# EAGLE design AMP 1.2 (EAGLE 6.5.0)
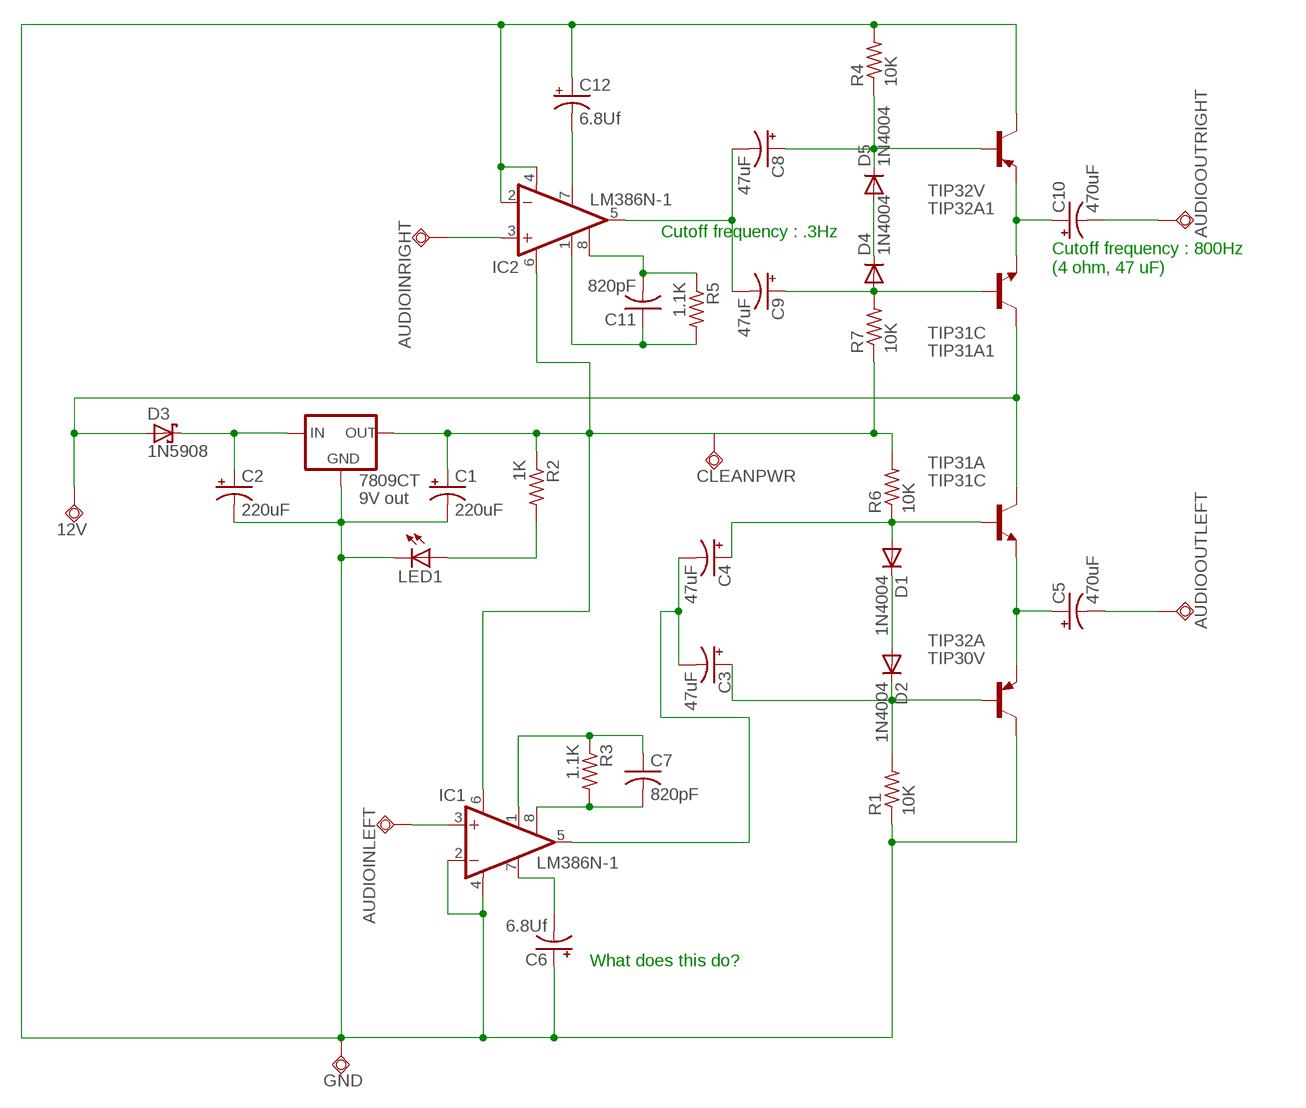
[diagram p0: schematic, sheet 1]

## Parts
12V  TPSQPAD1-20  [P1-20]
7809CT  9V out  78XXS  [78XXS]
AUDIOINLEFT  TPSQPAD1-20  [P1-20]
AUDIOINRIGHT  TPSQPAD1-20  [P1-20]
AUDIOOUTLEFT  TPSQPAD1-20  [P1-20]
AUDIOOUTRIGHT  TPSQPAD1-20  [P1-20]
C1  220uF  CPOL-USB45181C  [B45181C]
C2  220uF  CPOL-USB45181C  [B45181C]
C3  47uF  CPOL-USE5-4  [E5-4]
C4  47uF  CPOL-USE5-4  [E5-4]
C5  470uF  CPOL-USE5-4  [E5-4]
C6  6.8Uf  CPOL-USE5-4  [E5-4]
C7  820pF  C-US050-050X075  [C050-050X075]
C8  47uF  CPOL-USE5-4  [E5-4]
C9  47uF  CPOL-USE5-4  [E5-4]
C10  470uF  CPOL-USE5-4  [E5-4]
C11  820pF  C-US050-050X075  [C050-050X075]
C12  6.8Uf  CPOL-USE5-4  [E5-4]
CLEANPWR  TPSQPAD1-20  [P1-20]
D1  1N4004  [DO41-10]
D2  1N4004  [DO41-10]
D3  1N5908  [C4111-15]
D4  1N4004  [DO41-10]
D5  1N4004  [DO41-10]
GND  TPSQPAD1-20  [P1-20]
IC1  LM386N-1  [DIL08]
IC2  LM386N-1  [DIL08]
LED1  LED5MM  [LED5MM]
R1  10K  R-US_0204/7  [0204/7]
R2  1K  R-US_0204/7  [0204/7]
R3  1.1K  R-US_0204/7  [0204/7]
R4  10K  R-US_0204/7  [0204/7]
R5  1.1K  R-US_0204/7  [0204/7]
R6  10K  R-US_0204/7  [0204/7]
R7  10K  R-US_0204/7  [0204/7]
TIP31A  TIP31C  [TO220V]
TIP31A1  TIP31C  [TO220V]
TIP32A  TIP30V  [TO220V]
TIP32A1  TIP32V  [TO220V]

## Nets
AALFT: C3.- C4.- IC1.5(OUT)
AARGHT: C8.- C9.- IC2.5(OUT)
ALFT: AUDIOINLEFT.TP IC1.3(+IN)
ARGHT: AUDIOINRIGHT.TP IC2.3(+IN)
AULEFT: AUDIOOUTLEFT.TP C5.-
AURIGHT: AUDIOOUTRIGHT.TP C10.-
BUFFEREDDIRTY [Power]: 7809CT.IN C2.+ D3.C
CLEAN9V [Cleanpower]: 7809CT.OUT C1.+ CLEANPWR.TP IC1.6(VS) IC2.6(VS) R2.1 R6.2 R7.1
CLEANPWR: C4.+ D1.A R6.1 TIP31A.1(B)
DIRTYPWR [Power]: 12V.TP D3.A TIP31A1.2(C) TIP31A.2(C)
GND [Power]: 7809CT.GND C1.- C2.- C6.+ C12.+ GND.TP IC1.2(-IN) IC1.4(GND) IC2.2(-IN) IC2.4(GND) LED1.K(C) R1.1 R4.2 TIP32A1.2(C) TIP32A.2(C)
N$1: D1.C D2.A
N$2: C3.+ D2.C R1.2 TIP32A.1(B)
N$4: C5.+ TIP31A.3(E) TIP32A.3(E)
N$10: LED1.A R2.2
N$12: C6.- IC1.7(BYPASS)
N$13: C7.2 IC1.8(GAIN) R3.2
N$15: C7.1 IC1.1(GAIN) R3.1
N$16: C10.+ TIP31A1.3(E) TIP32A1.3(E)
N$17: C8.+ D5.C R4.1 TIP32A1.1(B)
N$18: C9.+ D4.A R7.2 TIP31A1.1(B)
N$19: D4.C D5.A
N$25: C11.2 IC2.8(GAIN) R5.1
N$26: C11.1 IC2.1(GAIN) R5.2
N$27: C12.- IC2.7(BYPASS)

## Notes on the sheet
- Cutoff frequency : .3Hz
- Cutoff frequency : 800Hz
  (4 ohm, 47 uF)
- What does this do?

## Library data of the parts
12V AUDIOINLEFT AUDIOINRIGHT AUDIOOUTLEFT AUDIOOUTRIGHT CLEANPWR GND = testpad:TPSQ: Test pad
7809CT = v-reg:78XXS: VOLTAGE REGULATOR
C1-C6 C8-C10 C12 = rcl:CPOL-US: POLARIZED CAPACITOR, American symbol
C7 C11 = rcl:C-US: CAPACITOR, American symbol
D1 D2 D4 D5 = diode:1N4004: DIODE general purpose rectifier, 1 A
D3 = diode:1N5908: DIODE schottky
IC1 IC2 = linear:LM386?-*: Low Voltage Audio Power Amplifier Source: http://cache.national.com/ds/LM/LM386.pdf
LED1 = led:LED: LED OSRAM: - CHIPLED LG R971, LG N971, LY N971, LG Q971, LY Q971, LO R971, LY R971 LH N974, LH R974 LS Q976, LO Q976, LY Q976 LO Q996 - Hyper CHIPLED LW Q18S LB Q993, LB Q99A, LB R99A - SideLED LS A670, LO A670, LY A670, LG A670, LP A670 LB A673, LV A673, LT A673, LW A673 LH A674 LY A675 LS A676, LA A676, LO A676, LY A676, LW A676 LS A679, LY A679, LG A679 - Hyper Micro SIDELED® LS Y876, LA Y876, LO Y876, LY Y876 LT Y87S - SmartLED LW L88C, LW L88S LB L89C, LB L89S, LG L890 LS L89K, LO L89K, LY L89K LS L896, LA L896, LO L896, LY L896 - TOPLED LS T670, LO T670, LY T670, LG T670, LP T670 LSG T670, LSP T670, LSY T670, LOP T670, LYG T670 LG T671, LOG T671, LSG T671 LB T673, LV T673, LT T673, LW T673 LH T674 LS T676, LA T676, LO T676, LY T676, LB T676, LH T676, LSB T676, LW T676 LB T67C, LV T67C, LT T67C, LS T67K, LO T67K, LY T67K, LW E67C LS E67B, LA E67B, LO E67B, LY E67B, LB E67C, LV E67C, LT E67C LW T67C LS T679, LY T679, LG T679 LS T770, LO T770, LY T770, LG T770, LP T770 LB T773, LV T773, LT T773, LW T773 LH T774 LS E675, LA E675, LY E675, LS T675 LS T776, LA T776, LO T776, LY T776, LB T776 LHGB T686 LT T68C, LB T68C - Hyper Mini TOPLED® LB M676 - Mini TOPLED Santana® LG M470 LS M47K, LO M47K, LY M47K Source: http://www.osram.convergy.de LUXEON: - LUMILED® LXK2-PW12-R00, LXK2-PW12-S00, LXK2-PW14-U00, LXK2-PW14-V00 LXK2-PM12-R00, LXK2-PM12-S00, LXK2-PM14-U00 LXK2-PE12-Q00, LXK2-PE12-R00, LXK2-PE12-S00, LXK2-PE14-T00, LXK2-PE14-U00 LXK2-PB12-K00, LXK2-PB12-L00, LXK2-PB12-M00, LXK2-PB14-N00, LXK2-PB14-P00, LXK2-PB14-Q00 LXK2-PR12-L00, LXK2-PR12-M00, LXK2-PR14-Q00, LXK2-PR14-R00 LXK2-PD12-Q00, LXK2-PD12-R00, LXK2-PD12-S00 LXK2-PH12-R00, LXK2-PH12-S00 LXK2-PL12-P00, LXK2-PL12-Q00, LXK2-PL12-R00 Source: www.luxeon.com KINGBRIGHT: KA-3528ASYC Source: www.kingbright.com
R1-R7 = rcl:R-US_: RESISTOR, American symbol
TIP31A TIP31A1 = transistor-npn:TIP31C*: NPN Transistor
TIP32A = transistor-pnp:TIP30: PNP Transistor
TIP32A1 = transistor:TIP32: PNP Transistor Medium Power Linear Switching Applications Source: http://onsemi.com

## Net classes
0 Signal: width 0.61 mm, clearance 0.762 mm
1 Power: width 1.27 mm, clearance 0.762 mm
2 Cleanpower: width 0.61 mm, clearance 0.762 mm

## Board
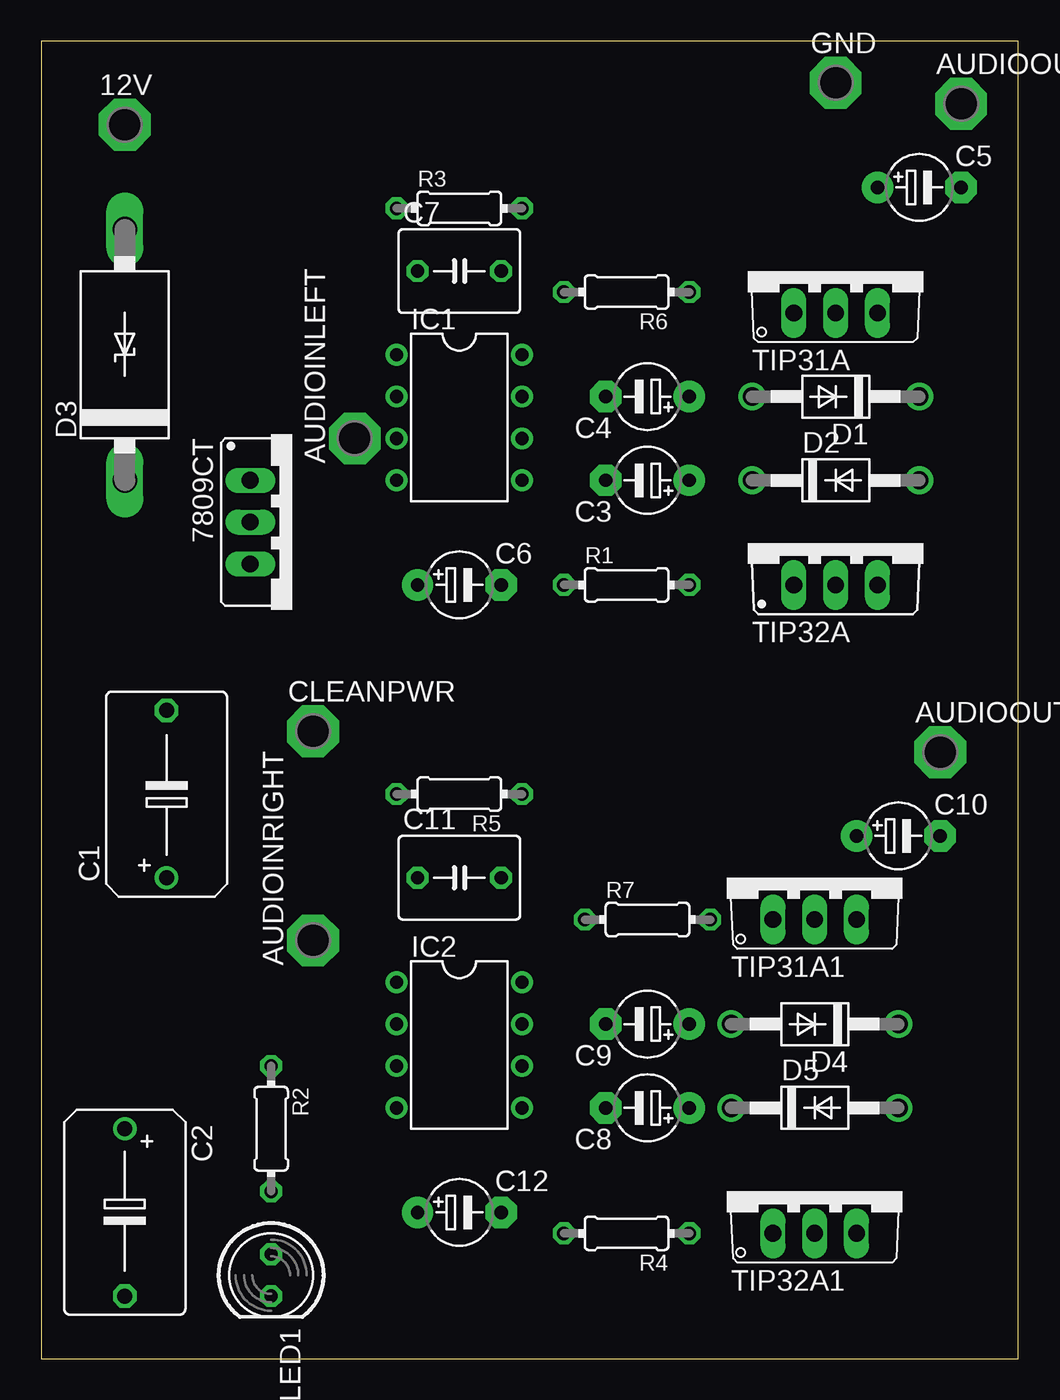
[diagram p1: board, top side]
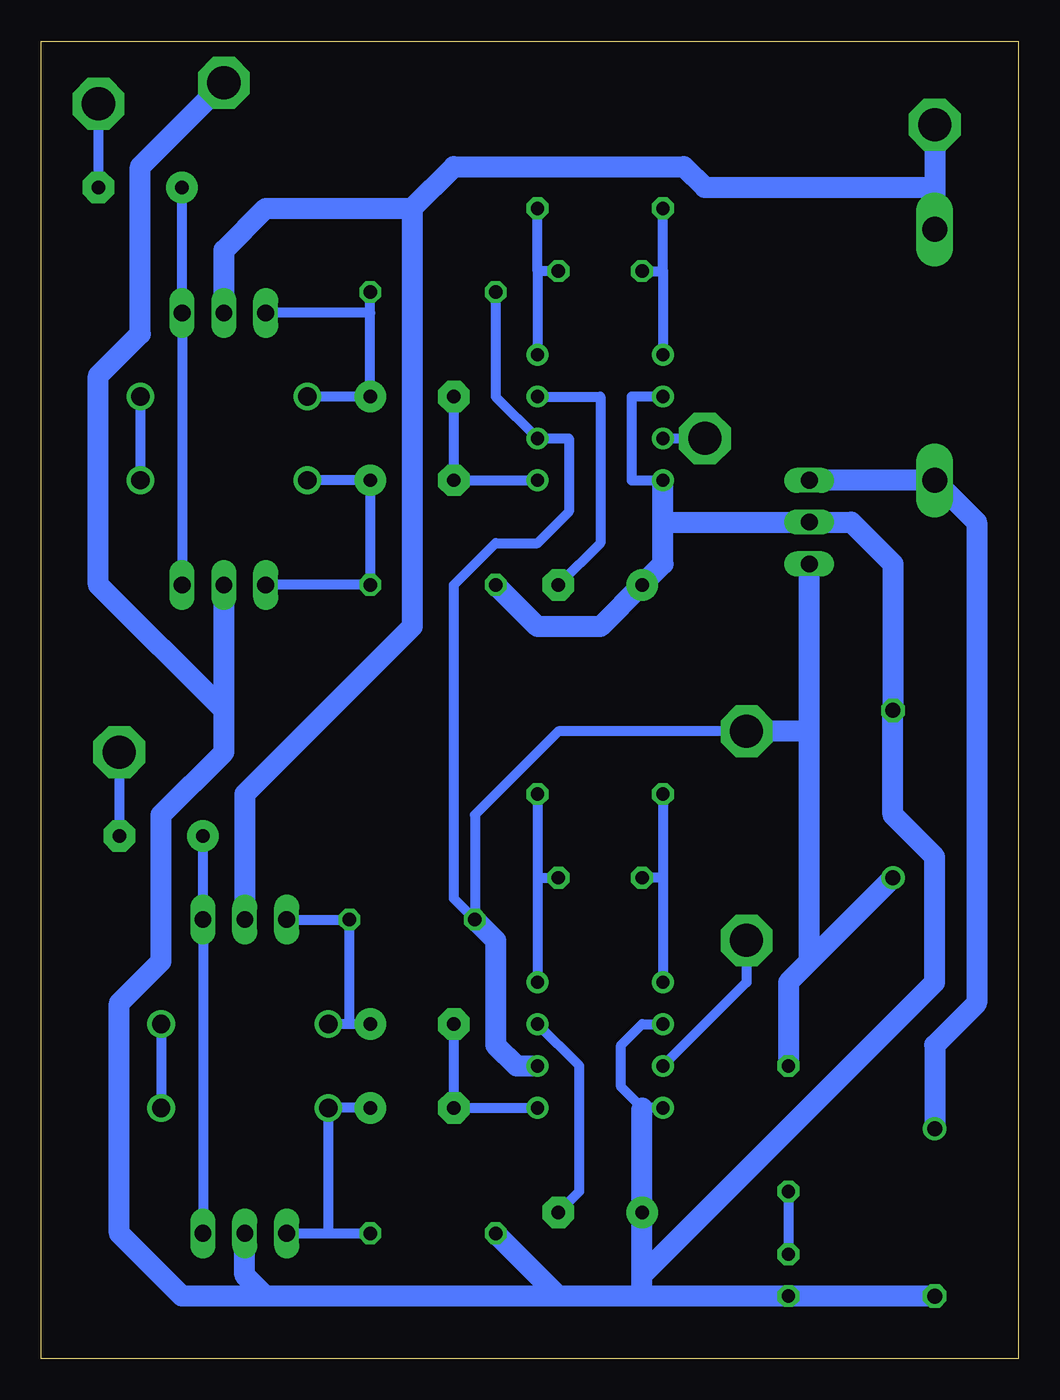
[diagram p2: board, bottom side, seen from below]

Size 59.36 x 80 mm. Coordinates in mm from the lower left corner, seen from the top.
Outline: 0,0 59.36,0 59.36,80 0,80 0,0
Copper layers (1*16): Top 0.035mm / dielectric 1.5mm / Bottom 0.035mm
Design rules "default": minimum track width 10mil, minimum drill 24mil, track to track 8mil, track to pad 8mil, pad to pad 8mil, via to via 8mil, smd to smd 8mil, copper to edge 40mil, drill to drill 8mil, minimum pad ring 10mil, minimum via ring 8mil, stop-mask expansion 4mil, vias tented up to drill 0mil, thermal gap 10mil

### Footprints (pad centres in the part's own frame; a part is rotated, then mirrored left to right if it is on the bottom)
P1-20 = drill 2.007 pad 3.15 octagon: TP 0,0
78XXS = drill 1.016 long: GND 0,-2.54; IN -2.54,-2.54; OUT 2.54,-2.54
B45181C = drill 0.914: + -5.08,0 | drill 0.914 octagon: - 5.08,0
E5-4 = drill 0.813 pad 1.905: + -2.54,0 | drill 0.813 pad 1.905 octagon: - 2.54,0
C050-050X075 = drill 0.813 octagon: 1 -2.54,0; 2 2.54,0
DO41-10 = drill 1.118: A 5.08,0; C -5.08,0
C4111-15 = drill 1.499 long: A 7.62,0; C -7.62,0
DIL08 = drill 0.813 pad 1.27: 1 -3.81,-3.81; 2 -1.27,-3.81; 3 1.27,-3.81; 4 3.81,-3.81; 5 3.81,3.81; 6 1.27,3.81; 7 -1.27,3.81; 8 -3.81,3.81
LED5MM = drill 0.813 octagon: A -1.27,0; K 1.27,0
0204/7 = drill 0.813 octagon: 1 -3.81,0; 2 3.81,0
TO220V = drill 1.016 long: 1 -2.54,-2.54; 2 0,-2.54; 3 2.54,-2.54

### Placement (x,y rotation side)
12V  5.08,74.93 0 top
7809CT  15.24,50.8 270 top
AUDIOINLEFT  19.05,55.88 90 top
AUDIOINRIGHT  16.51,25.4 90 top
AUDIOOUTLEFT  55.88,76.2 0 top
AUDIOOUTRIGHT  54.61,36.83 0 top
C1  7.62,34.29 90 top
C2  5.08,8.89 270 top
C3  36.83,53.34 180 top
C4  36.83,58.42 180 top
C5  53.34,71.12 0 top
C6  25.4,46.99 0 top
C7  25.4,66.04 0 top
C8  36.83,15.24 180 top
C9  36.83,20.32 180 top
C10  52.07,31.75 0 top
C11  25.4,29.21 0 top
C12  25.4,8.89 0 top
CLEANPWR  16.51,38.1 0 top
D1  48.26,58.42 180 top
D2  48.26,53.34 0 top
D3  5.08,60.96 90 top
D4  46.99,20.32 180 top
D5  46.99,15.24 0 top
GND  48.26,77.47 0 top
IC1  25.4,57.15 270 top
IC2  25.4,19.05 270 top
LED1  13.97,5.08 270 top
R1  35.56,46.99 0 top
R2  13.97,13.97 270 top
R3  25.4,69.85 0 top
R4  35.56,7.62 180 top
R5  25.4,34.29 180 top
R6  35.56,64.77 180 top
R7  36.83,26.67 0 top
TIP31A  48.26,66.04 0 top
TIP31A1  46.99,29.21 0 top
TIP32A  48.26,49.53 0 top
TIP32A1  46.99,10.16 0 top

### Tracks (layer width: path | path; a pad name or v marks a point on that pad's centre or on a via)
AALFT
  Bottom 0.61: IC1.5 C3.- C4.-
AARGHT
  Bottom 0.61: IC2.5 C8.- C9.-
ALFT
  Bottom 0.61: IC1.3 AUDIOINLEFT.TP
ARGHT
  Bottom 0.61: IC2.3 16.51,22.86 AUDIOINRIGHT.TP
AULEFT
  Bottom 0.61: AUDIOOUTLEFT.TP C5.-
AURIGHT
  Bottom 0.61: AUDIOOUTRIGHT.TP C10.-
BUFFEREDDIRTY
  Bottom 1.27: C2.+ 5.08,19.05 2.54,21.59 2.54,50.8 D3.C 7809CT.IN
CLEAN9V
  Bottom 0.61: R6.2 31.75,58.42 IC1.6 27.3,55.88 27.3,51.44 29.21,49.53 31.75,49.53 34.29,46.99 34.29,27.94 R7.1 33.02,33.02 27.94,38.1 CLEANPWR.TP
  Bottom 1.27: R2.1 13.97,22.86 12.7,24.13 | C1.+ 12.7,24.13 | 12.7,24.13 12.7,38.1 | 12.7,38.1 7809CT.OUT | 12.7,38.1 CLEANPWR.TP | IC2.6 30.48,17.78 31.75,19.05 31.75,25.4 R7.1
CLEANPWR
  Bottom 0.61: 39.37,63.5 C4.+ D1.A | 39.37,63.5 R6.1 | 39.37,63.5 TIP31A.1
DIRTYPWR
  Bottom 1.27: 12V.TP 5.08,71.12 | 5.08,71.12 D3.A | TIP31A1.2 46.99,34.29 36.83,44.45 36.83,69.85 | 36.83,69.85 45.72,69.85 48.26,67.31 TIP31A.2 | 5.08,71.12 19.05,71.12 20.32,72.39 34.29,72.39 36.83,69.85
GND
  Bottom 0.61: IC2.4 22.86,15.24 24.13,16.51 24.13,19.05 22.86,20.32 IC2.2 | IC1.2 23.5,58.42 23.5,53.34 IC1.4
  Bottom 1.27: 21.59,50.8 21.59,48.26 C6.+ 25.4,44.45 29.21,44.45 R1.1 | 21.59,50.8 IC1.4 | 21.59,50.8 7809CT.GND 10.16,50.8 7.62,48.26 C1.- 7.62,33.02 5.08,30.48 5.08,22.86 22.86,5.08 | C2.- LED1.K 22.86,3.81 | 27.94,3.81 R4.2 | 22.86,3.81 27.94,3.81 | TIP32A1.2 46.99,5.08 45.72,3.81 | 27.94,3.81 45.72,3.81 | 48.26,39.37 48.26,36.83 52.07,33.02 52.07,24.13 54.61,21.59 54.61,7.62 50.8,3.81 45.72,3.81 | 48.26,39.37 TIP32A.2 | 22.86,3.81 22.86,5.08 | 22.86,5.08 C12.+ 22.86,15.24 | GND.TP 53.34,72.39 53.34,62.23 55.88,59.69 55.88,46.99 48.26,39.37
N$1
  Bottom 0.61: D1.C D2.A
N$2
  Bottom 0.61: TIP32A.1 R1.2 C3.+ D2.C
N$4
  Bottom 0.61: TIP32A.3 TIP31A.3 C5.+
N$10
  Bottom 0.61: R2.2 LED1.A
N$12
  Bottom 0.61: IC1.7 25.4,58.42 25.4,49.53 C6.-
N$13
  Bottom 0.61: 29.21,66.04 IC1.8 | C7.2 29.21,66.04 | 29.21,66.04 R3.2
N$15
  Bottom 0.61: 21.59,66.04 IC1.1 | C7.1 21.59,66.04 | 21.59,66.04 R3.1
N$16
  Bottom 0.61: TIP32A1.3 TIP31A1.3 C10.+
N$17
  Bottom 0.61: C8.+ D5.C 41.91,7.62 | TIP32A1.1 41.91,7.62 | 41.91,7.62 R4.1
N$18
  Bottom 0.61: TIP31A1.1 R7.2 40.64,20.32 | C9.+ 40.64,20.32 | 40.64,20.32 D4.A
N$19
  Bottom 0.61: D4.C D5.A
N$25
  Bottom 0.61: R5.1 29.21,29.21 | 29.21,29.21 IC2.8 | 29.21,29.21 C11.2
N$26
  Bottom 0.61: R5.2 21.59,29.21 | 21.59,29.21 IC2.1 | 21.59,29.21 C11.1
N$27
  Bottom 0.61: IC2.7 26.67,17.78 26.67,10.16 C12.-